# EasyEDA schematic SCH_NSL-23-24_2023-12-20.json

## Sheets
1 Main System: TITLE: Main System; REV: 1.0; Date: 2023-10-05; Sheet: 1/1; Drawn By: lazaro.aj.80s; Company: SOAR
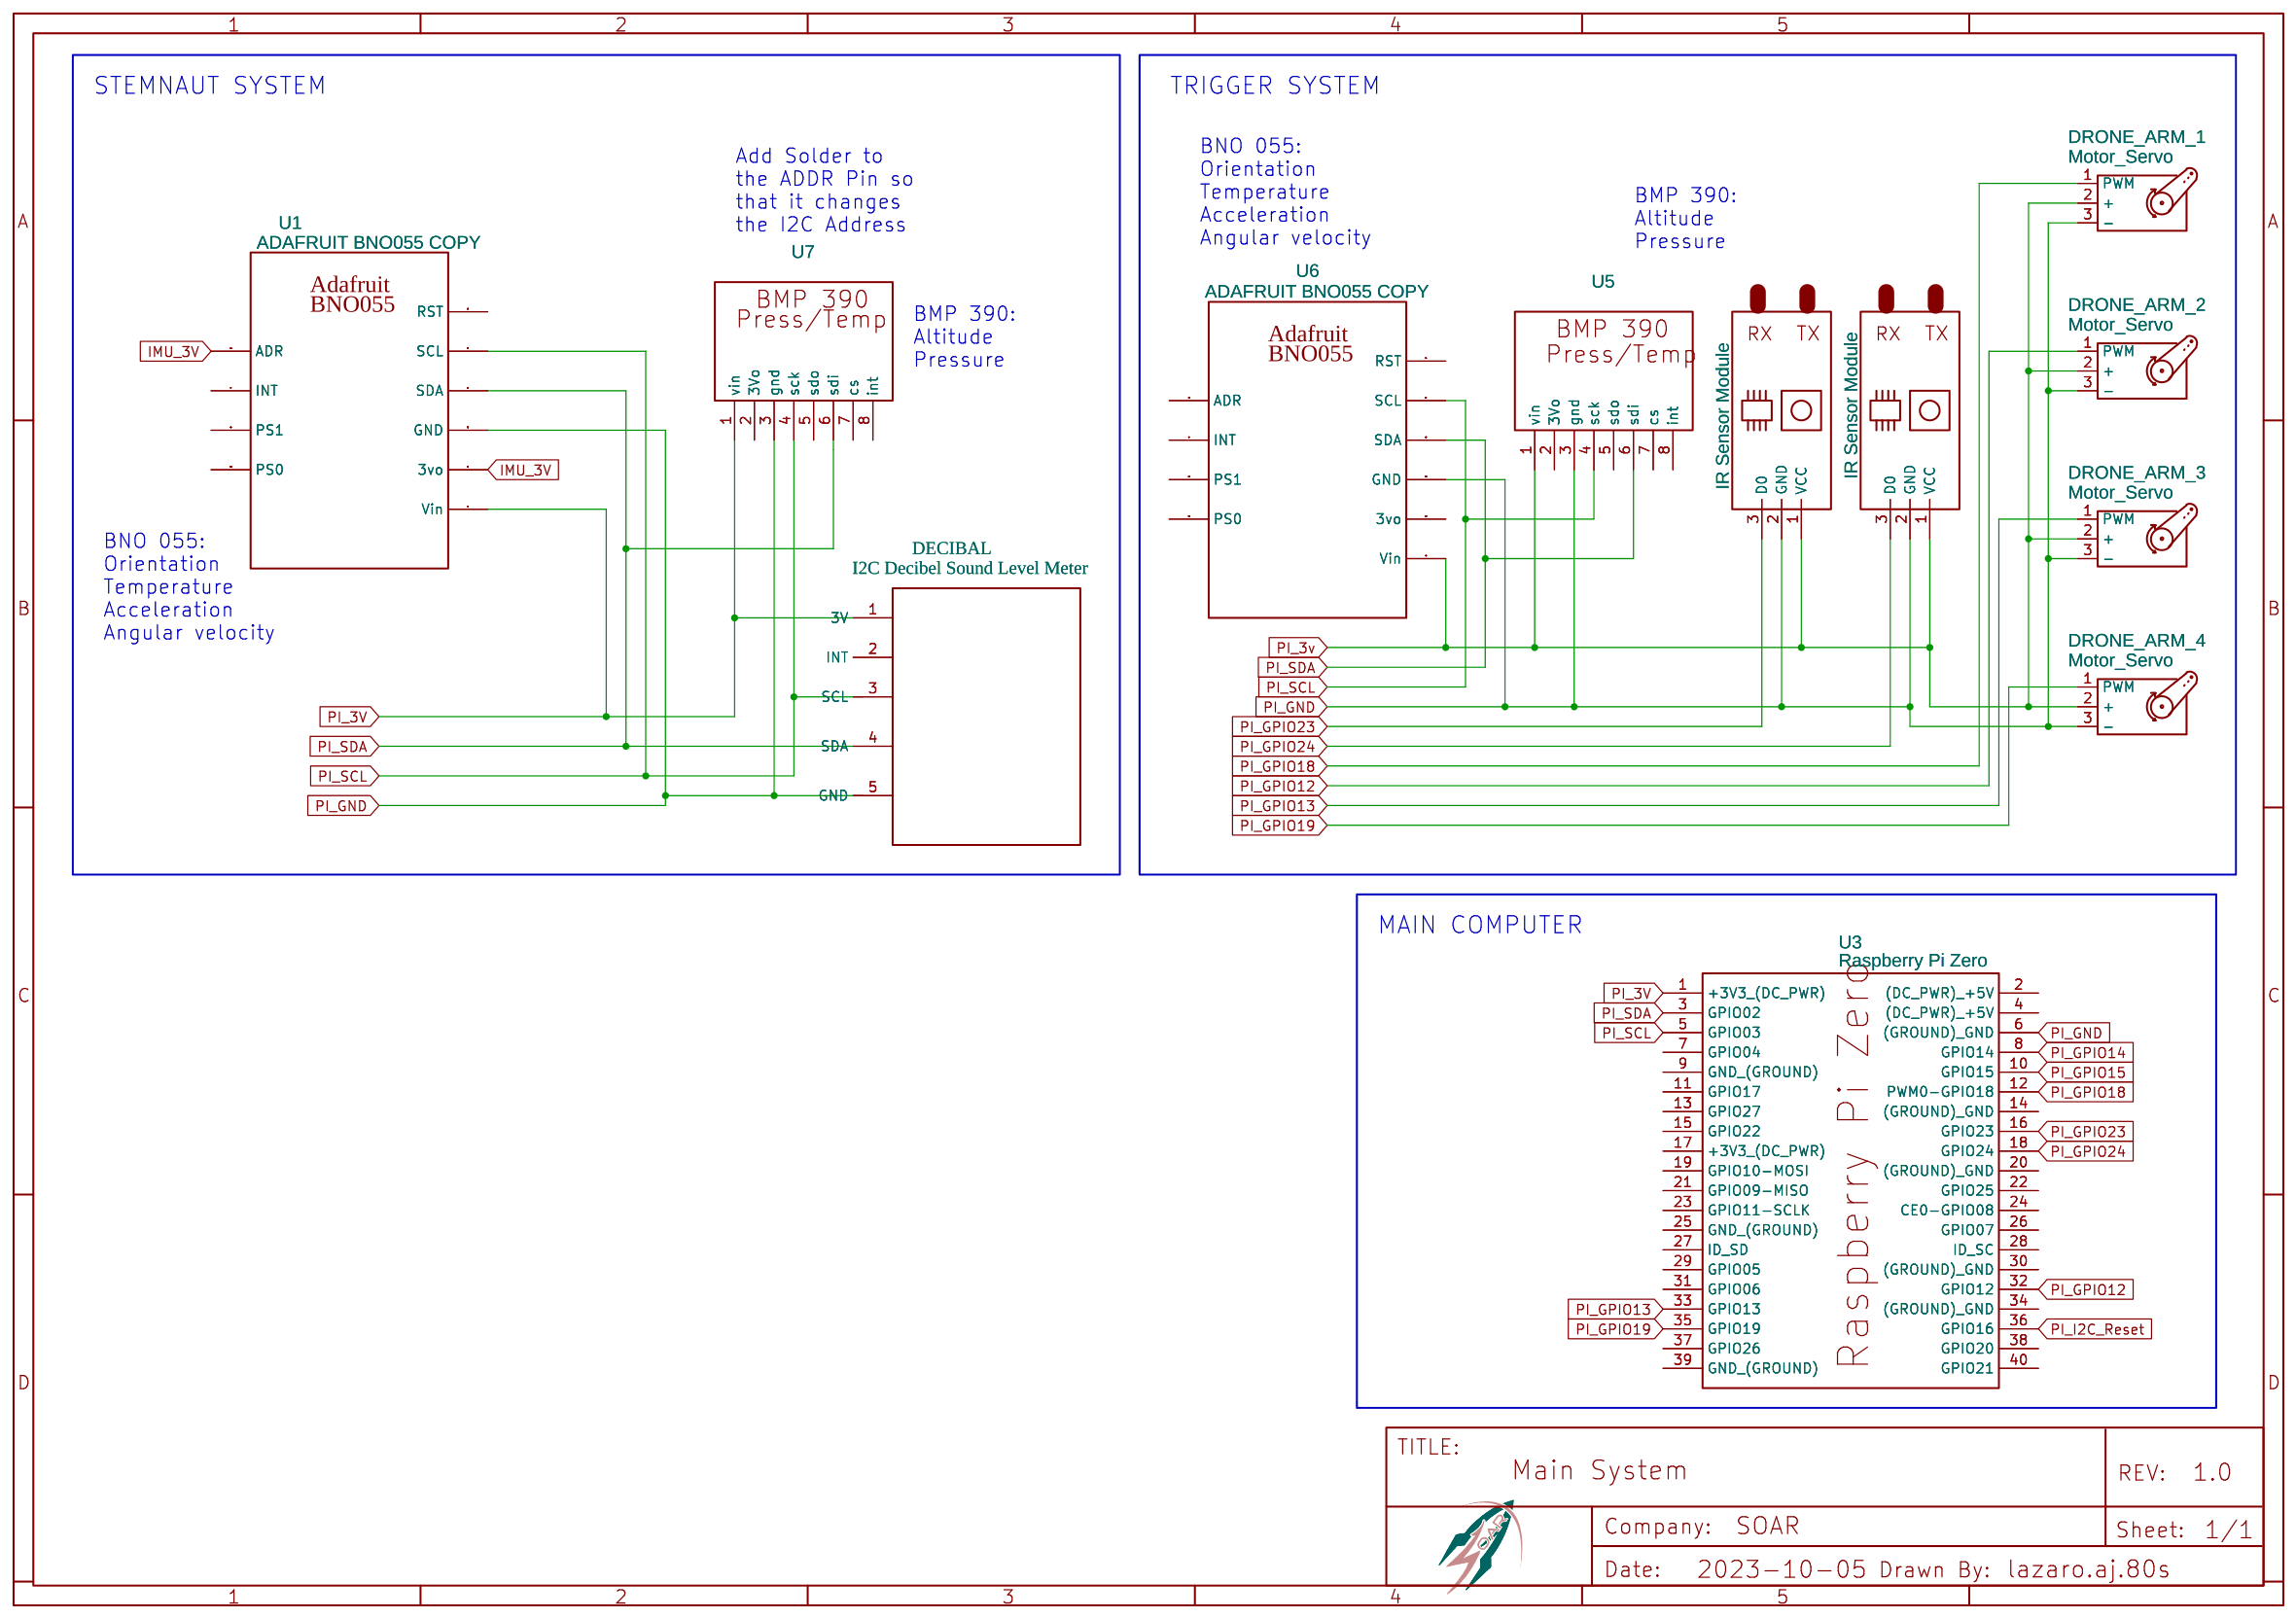
[diagram p0: Main System]
2 Deployment System: TITLE: Deployment System; Date: 2023-10-20; Drawn By: esenior1
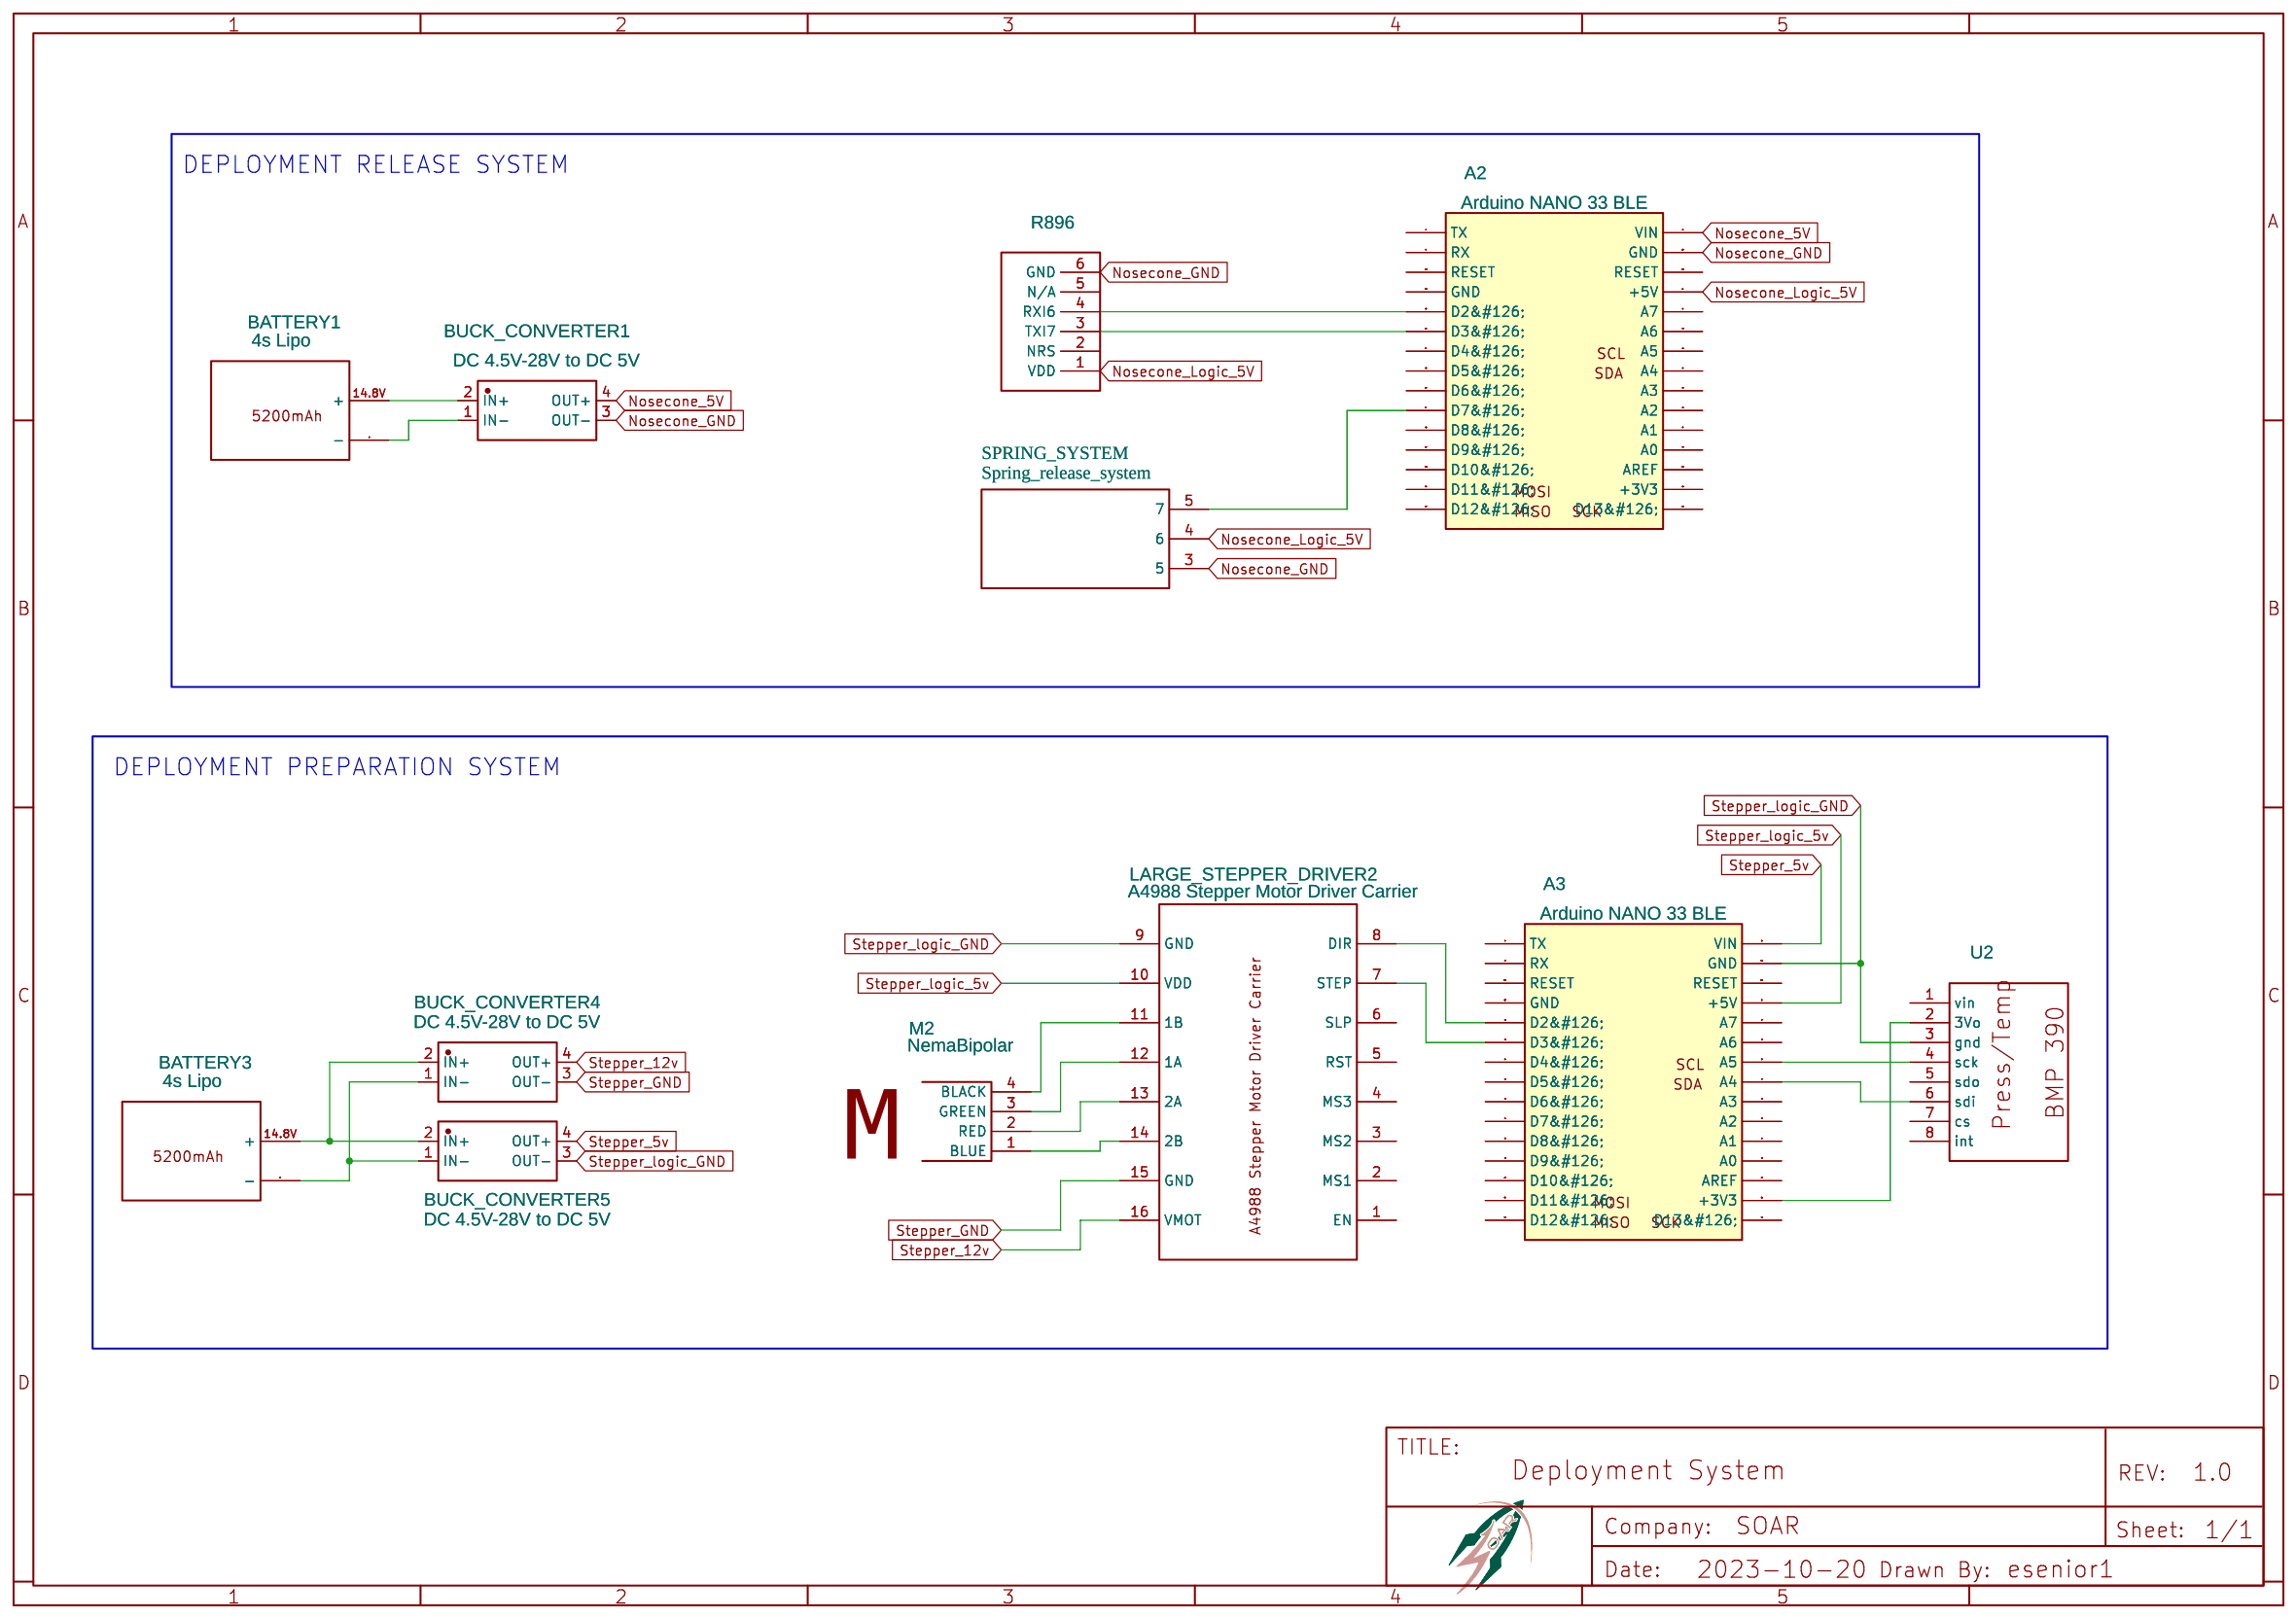
[diagram p1: Deployment System]
3 Ground Computer: TITLE: Sheet_1; Date: 2023-12-10; Company: Your Company
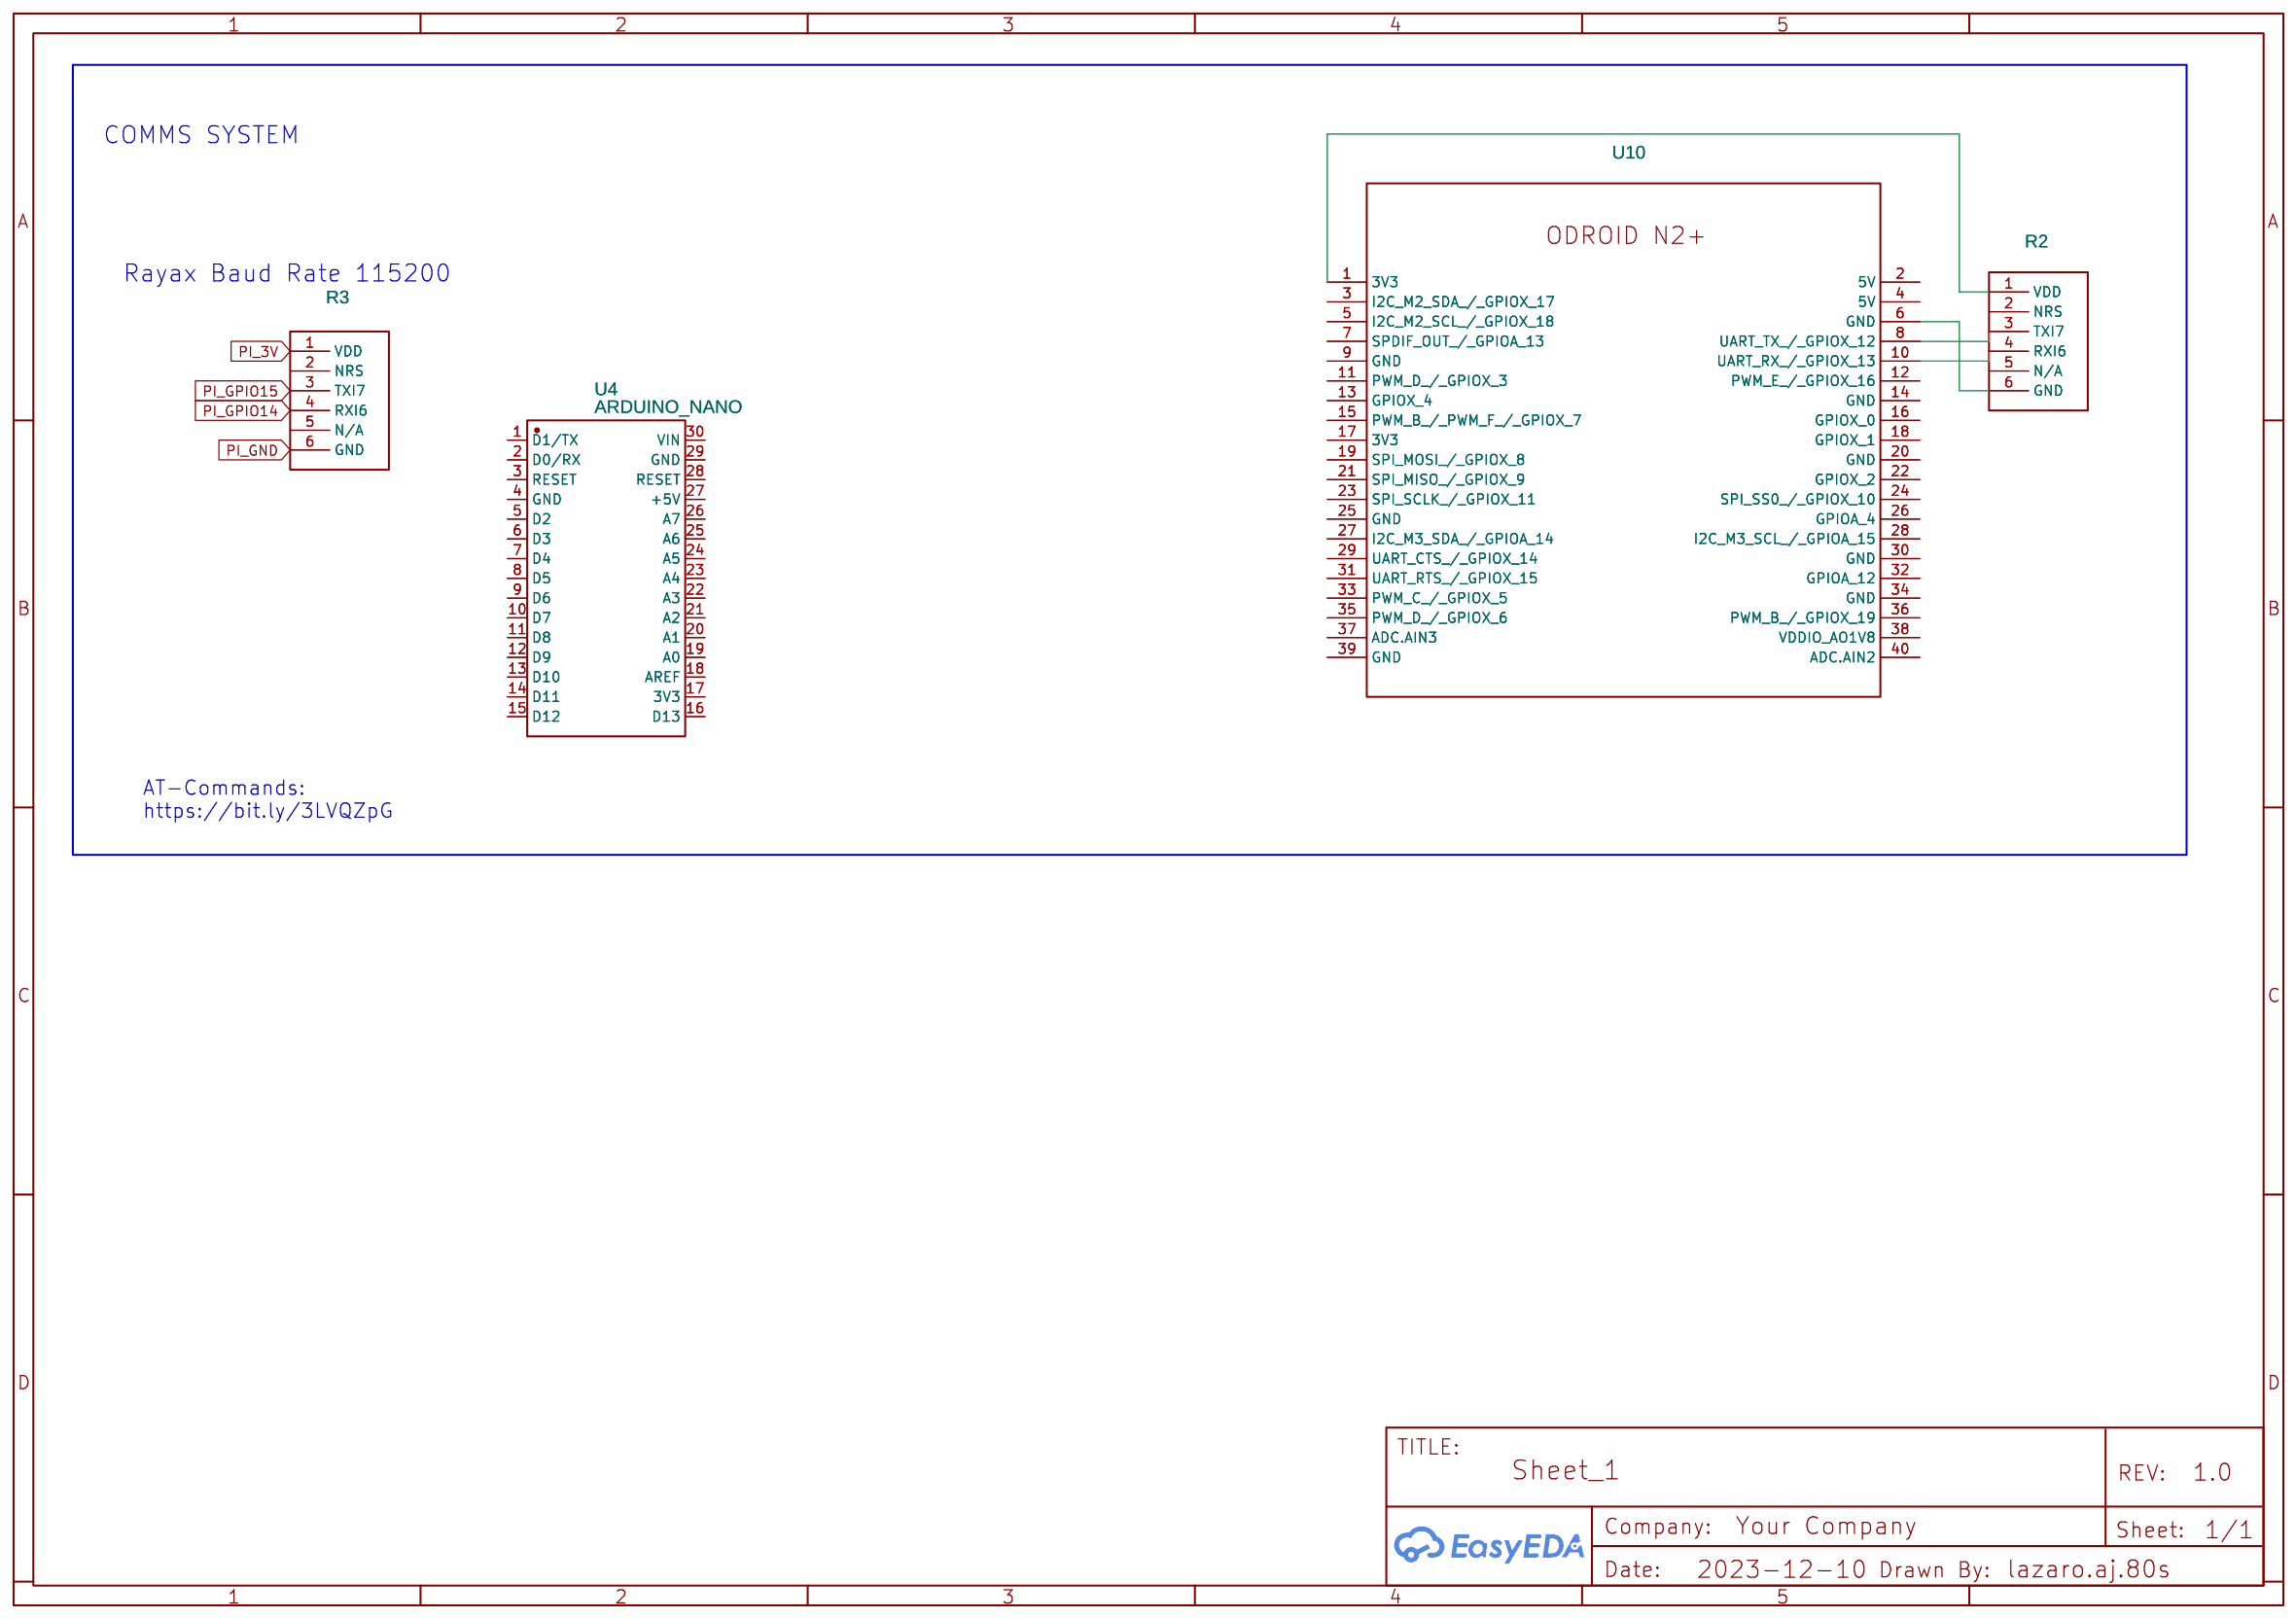
[diagram p2: Ground Computer]

## Parts
sheet Deployment System
A2  Arduino NANO 33 BLE  [ARDUINO NANO 33 BLE]
A3  Arduino NANO 33 BLE  [ARDUINO NANO 33 BLE]
BATTERY1  4s Lipo
BATTERY3  4s Lipo
BUCK_CONVERTER1  DC 4.5V-28V to DC 5V  [BUCK-CONVERTER]
BUCK_CONVERTER4  DC 4.5V-28V to DC 5V  [BUCK-CONVERTER]
BUCK_CONVERTER5  DC 4.5V-28V to DC 5V  [BUCK-CONVERTER]
LARGE_STEPPER_DRIVER2  A4988 Stepper Motor Driver Carrier  [A4988 STEPPER MOTOR DRIVER CARRIER]
M2  NemaBipolar
R896  NO  [REYAX896]
SPRING_SYSTEM  Spring_release_system
U2  NO  [ADAFRUIT BMP390]
sheet Ground Computer
R2  NO  [REYAX896]
R3  NO  [REYAX896]
U4  ARDUINO_NANO  [COMM-TH_ARDUINO_NANO]
U10  NO  [ODROID N2+]
sheet Main System
DECIBAL  I2C Decibel Sound Level Meter
DRONE_ARM_1  Motor_Servo
DRONE_ARM_2  Motor_Servo
DRONE_ARM_3  Motor_Servo
DRONE_ARM_4  Motor_Servo
NO2  IR Sensor Module  [LIGHT MODULE]
NO3  IR Sensor Module  [LIGHT MODULE]
U1  ADAFRUIT BNO055 COPY  [ADAFRUIT BNO055]
U3  Raspberry Pi Zero  [RASPBERRY-PI-ZERO V1]
U5  NO  [ADAFRUIT BMP390]
U6  ADAFRUIT BNO055 COPY  [ADAFRUIT BNO055]
U7  NO  [ADAFRUIT BMP390]

## Library data of the parts
A2 A3 = Arduino NANO 33 BLE: Contributor: Joni
BATTERY1 BATTERY3 = BateriaLiPo: catid: 20; Contributor: Douglas Maciel; sim: true
BUCK_CONVERTER1 BUCK_CONVERTER4 BUCK_CONVERTER5 = DC 4.5V-28V to DC 0.8V-20V: Manufacturer: Senbeeda; Supplier: Amazon; link: https://www.amazon.de/dp/B09K3H72QV/ref=sspa_dk_detail_0?psc=1&pd_rd_i=B09K3H72QV&pd_rd_w=GWxYY&content-id=amzn1.sym.d653785b-379e-4f45-87ba-2d67ddb0eb39&pf_rd_p=d653785b-379e-4f45-87ba-2d67ddb0eb39&pf_rd_r=VZXNJFZHK4SZKV3R87E4&pd_rd_wg=7yFbf&pd_rd_r=e4c2ed65-c0a7-42e0-b905-ac518888ed16&s=diy&spLa=ZW5jcnlwdGVkUXVhbGlmaWVyPUEzT1JSUUZXTlBIRzk3JmVuY3J5cHRlZElkPUEwMDY2MzE1MkcwWjZUN002Tzg5SyZlbmNyeXB0ZWRBZElkPUEwMTQ2ODE2M0taUlkwUkFINkoyQyZ3aWRnZXROYW1lPXNwX2RldGFpbDImYWN0aW9uPWNsaWNrUmVkaXJlY3QmZG9Ob3RMb2dDbGljaz10cnVl; Contributor: calautigo
LARGE_STEPPER_DRIVER2 = A4988 Stepper Motor Driver Carrier: Contributor: winter2015; sourceId: YsmgyP7pj
M2 = NemaBipolar: Contributor: zmanpac
R2 R3 R896 = REYAX896: Contributor: alejoespinel
U2 U5 U7 = BMP390 - BAROMETRIC PRESSURE AND ALTIMETER: Manufacturer: Adafruit; Manufacturer Part: Adafruit; Supplier Part: 3966; Supplier: Adafruit; link: https://www.adafruit.com/product/3966; Contributor: Andre C
U4 = ARDUINO_NANO: Contributor: lcsc; Supplier: LCSC; Supplier Part: C9900017879; Manufacturer: null; JLCPCB Part Class: Extended Part
U10 = Odroid N2+: Contributor: Dev 91
DRONE_ARM_1-DRONE_ARM_4 = Motor_Servo: Contributor: KiCAD; license: https://www.gnu.org/licenses/lgpl-2.1.html
NO2 NO3 = IR Sensor Module - ElectroDino.com: Manufacturer: https://www.aliexpress.com/item/1PCS-Optical-Sensitive-Resistance-Light-Detection-Photosensitive-Sensor-Module-for-arduino-4pin-DIY-Kit/32925178133.html?spm=2114.search0604.3.9.41d9103fwqX3FB&ws_ab_test=searchweb0_0,searchweb201602_6_10065_10068_319_317_10696_453_10084_454_10083_10618_10307_10301_537_536_10059_10884_10889_10887_321_322_10915_10103_10914_10911_10910,searchweb201603_52,ppcSwitch_0&algo_expid=1c0dc417-42b4-48cf-bcaf-114fccee5123-1&algo_pvid=1c0dc417-42b4-48cf-bcaf-114fccee5123; Manufacturer Part: Photosensitive Sensor Module; Contributor: Sourav Kar Mahapatra (ELECTRODUINO); link: https://www.electroduino.com/
U1 U6 = ADAFRUIT BNO055 COPY: Manufacturer: Adafruit; Manufacturer Part: 2472; Supplier: Mouser; Supplier Part: 485-2472; link: https://www.mouser.com/datasheet/2/737/adafruit-bno055-absolute-orientation-sensor-1006287.pdf; Contributor: markaldritzdv
U3 = Raspberry Pi Zero: Contributor: alexbrockman81

## Nets
IMU_3V: U1.3vo U1.ADR
Nosecone_5V: A2.VIN BUCK_CONVERTER1.4(OUT+)
Nosecone_GND: A2.GND1(GND) BUCK_CONVERTER1.3(OUT-) R896.6(GND) SPRING_SYSTEM.3(5)
Nosecone_Logic_5V: A2.5V(+5V) R896.1(VDD) SPRING_SYSTEM.4(6)
PI_3V: R3.1(VDD) U1.Vin U3.1(+3V3 (DC PWR)) U7.1(vin)
PI_3v: DRONE_ARM_1.2(+) DRONE_ARM_2.2(+) DRONE_ARM_3.2(+) DRONE_ARM_4.2(+) NO2.1(VCC) NO3.1(VCC) U5.1(vin) U6.Vin
PI_GND: DRONE_ARM_1.3(-) DRONE_ARM_2.3(-) DRONE_ARM_3.3(-) DRONE_ARM_4.3(-) NO2.2(GND) NO3.2(GND) R3.6(GND) U1.GND U3.6((GROUND) GND) U5.3(gnd) U6.GND U7.3(gnd)
PI_GPIO12: DRONE_ARM_2.1(PWM) U3.32(GPIO12)
PI_GPIO13: DRONE_ARM_3.1(PWM) U3.33(GPIO13)
PI_GPIO14: R3.4(RXI6) U3.8(GPIO14)
PI_GPIO15: R3.3(TXI7) U3.10(GPIO15)
PI_GPIO18: DRONE_ARM_1.1(PWM) U3.12(PWM0-GPIO18)
PI_GPIO19: DRONE_ARM_4.1(PWM) U3.35(GPIO19)
PI_GPIO23: NO3.3(D0) U3.16(GPIO23)
PI_GPIO24: NO2.3(D0) U3.18(GPIO24)
PI_I2C_Reset: U3.36(GPIO16)
PI_SCL: U1.SCL U3.5(GPIO03) U5.4(sck) U6.SCL U7.4(sck)
PI_SDA: U1.SDA U3.3(GPIO02) U5.6(sdi) U6.SDA U7.6(sdi)
Stepper_5v: A3.VIN BUCK_CONVERTER5.4(OUT+)
Stepper_12v: BUCK_CONVERTER4.4(OUT+) LARGE_STEPPER_DRIVER2.16(VMOT)
Stepper_GND: BUCK_CONVERTER4.3(OUT-) LARGE_STEPPER_DRIVER2.15(GND)
Stepper_logic_5v: A3.5V(+5V) LARGE_STEPPER_DRIVER2.10(VDD)
Stepper_logic_GND: A3.GND1(GND) BUCK_CONVERTER5.3(OUT-) LARGE_STEPPER_DRIVER2.9(GND) U2.3(gnd)
Net-(A2-D2): A2.D2(D2&#126;) R896.4(RXI6)
Net-(A2-D3): A2.D3(D3&#126;) R896.3(TXI7)
Net-(A2-D7): A2.D7(D7&#126;) SPRING_SYSTEM.5(7)
Net-(A3-3V3): A3.3V3(+3V3) U2.2(3Vo)
Net-(A3-A4): A3.A4 U2.6(sdi)
Net-(A3-A5): A3.A5 U2.4(sck)
Net-(A3-D2): A3.D2(D2&#126;) LARGE_STEPPER_DRIVER2.8(DIR)
Net-(A3-D3): A3.D3(D3&#126;) LARGE_STEPPER_DRIVER2.7(STEP)
Net-(BATTERY1-2): BATTERY1.2(-) BUCK_CONVERTER1.1(IN-)
Net-(BATTERY1-14.8V): BATTERY1.14.8V(+) BUCK_CONVERTER1.2(IN+)
Net-(BATTERY3-2): BATTERY3.2(-) BUCK_CONVERTER4.1(IN-) BUCK_CONVERTER5.1(IN-)
Net-(BATTERY3-14.8V): BATTERY3.14.8V(+) BUCK_CONVERTER4.2(IN+) BUCK_CONVERTER5.2(IN+)
Net-(LARGE_STEPPER_DRIVER2-11): LARGE_STEPPER_DRIVER2.11(1B) M2.4(BLACK)
Net-(LARGE_STEPPER_DRIVER2-12): LARGE_STEPPER_DRIVER2.12(1A) M2.3(GREEN)
Net-(LARGE_STEPPER_DRIVER2-13): LARGE_STEPPER_DRIVER2.13(2A) M2.2(RED)
Net-(LARGE_STEPPER_DRIVER2-14): LARGE_STEPPER_DRIVER2.14(2B) M2.1(BLUE)
Net-(R2-1): R2.1(VDD) U10.1(3V3)
Net-(R2-3): R2.3(TXI7) U10.8(UART_TX / GPIOX_12)
Net-(R2-4): R2.4(RXI6) U10.10(UART_RX / GPIOX_13)
Net-(R2-6): R2.6(GND) U10.6(GND)

Not connected (* = marked no-connect by the designer): A2 3V3(+3V3) A0 A1 A2 A3 A4 A5 A6 A7 AREF D4(D4&#126;) D5(D5&#126;) D6(D6&#126;) D8(D8&#126;) D9(D9&#126;) D10(D10&#126;) D11(D11&#126;) D12(D12&#126;) D13(D13&#126;) GND2(GND) RESET1(RESET) RESET2(RESET) RX TX; A3 A0 A1 A2 A3 A6 A7 AREF D4(D4&#126;) D5(D5&#126;) D6(D6&#126;) D7(D7&#126;) D8(D8&#126;) D9(D9&#126;) D10(D10&#126;) D11(D11&#126;) D12(D12&#126;) D13(D13&#126;) GND2(GND) RESET1(RESET) RESET2(RESET) RX TX; DECIBAL 1(3V) 2(INT) 3(SCL) 4(SDA) 5(GND); LARGE_STEPPER_DRIVER2 1(EN) 2(MS1) 3(MS2) 4(MS3) 5(RST) 6(SLP); R2 2(NRS) 5(N/A); R3 2(NRS) 5(N/A); R896 2(NRS) 5(N/A); U1 INT PS0 PS1 RST; U2 1(vin) 5(sdo) 7(cs) 8(int); U3 2((DC PWR) +5V) 4((DC PWR) +5V) 7(GPIO04) 9(GND (GROUND)) 11(GPIO17) 13(GPIO27) 14((GROUND) GND) 15(GPIO22) 17(+3V3 (DC PWR)) 19(GPIO10-MOSI) 20((GROUND) GND) 21(GPIO09-MISO) 22(GPIO25) 23(GPIO11-SCLK) 24(CE0-GPIO08) 25(GND (GROUND)) 26(GPIO07) 27(ID_SD) 28(ID_SC) 29(GPIO05) 30((GROUND) GND) 31(GPIO06) 34((GROUND) GND) 37(GPIO26) 38(GPIO20) 39(GND (GROUND)) 40(GPIO21); U4 1(D1/TX) 2(D0/RX) 3(RESET) 4(GND) 5(D2) 6(D3) 7(D4) 8(D5) 9(D6) 10(D7) 11(D8) 12(D9) 13(D10) 14(D11) 15(D12) 16(D13) 17(3V3) 18(AREF) 19(A0) 20(A1) 21(A2) 22(A3) 23(A4) 24(A5) 25(A6) 26(A7) 27(+5V) 28(RESET) 29(GND) 30(VIN); U5 2(3Vo) 5(sdo) 7(cs) 8(int); U6 3vo ADR INT PS0 PS1 RST; U7 2(3Vo) 5(sdo) 7(cs) 8(int); U10 2(5V) 3(I2C_M2_SDA / GPIOX_17) 4(5V) 5(I2C_M2_SCL / GPIOX_18) 7(SPDIF_OUT / GPIOA_13) 9(GND) 11(PWM_D / GPIOX_3) 12(PWM_E / GPIOX_16) 13(GPIOX_4) 14(GND) 15(PWM_B / PWM_F / GPIOX_7) 16(GPIOX_0) 17(3V3) 18(GPIOX_1) 19(SPI_MOSI / GPIOX_8) 20(GND) 21(SPI_MISO / GPIOX_9) 22(GPIOX_2) 23(SPI_SCLK / GPIOX_11) 24(SPI_SS0 / GPIOX_10) 25(GND) 26(GPIOA_4) 27(I2C_M3_SDA / GPIOA_14) 28(I2C_M3_SCL / GPIOA_15) 29(UART_CTS / GPIOX_14) 30(GND) 31(UART_RTS / GPIOX_15) 32(GPIOA_12) 33(PWM_C / GPIOX_5) 34(GND) 35(PWM_D / GPIOX_6) 36(PWM_B / GPIOX_19) 37(ADC.AIN3) 38(VDDIO_AO1V8) 39(GND) 40(ADC.AIN2)

## Notes on the sheets
sheet 1
- STEMNAUT SYSTEM
- TRIGGER SYSTEM
- BNO 055:
  Orientation
  Temperature
  Acceleration
  Angular velocity
- Add Solder to
  the ADDR Pin so
  that it changes
  the I2C Address
- BMP 390:
  Altitude
  Pressure
- BMP 390:
  Altitude
  Pressure
- BNO 055:
  Orientation
  Temperature
  Acceleration
  Angular velocity
- MAIN COMPUTER
sheet 2
- DEPLOYMENT RELEASE SYSTEM
- DEPLOYMENT PREPARATION SYSTEM
sheet 3
- COMMS SYSTEM
- Rayax Baud Rate 115200
- AT-Commands:
  https://bit.ly/3LVQZpG
